# EAGLE design MAIN_PCB_[V0.2] (EAGLE 9.6.2)
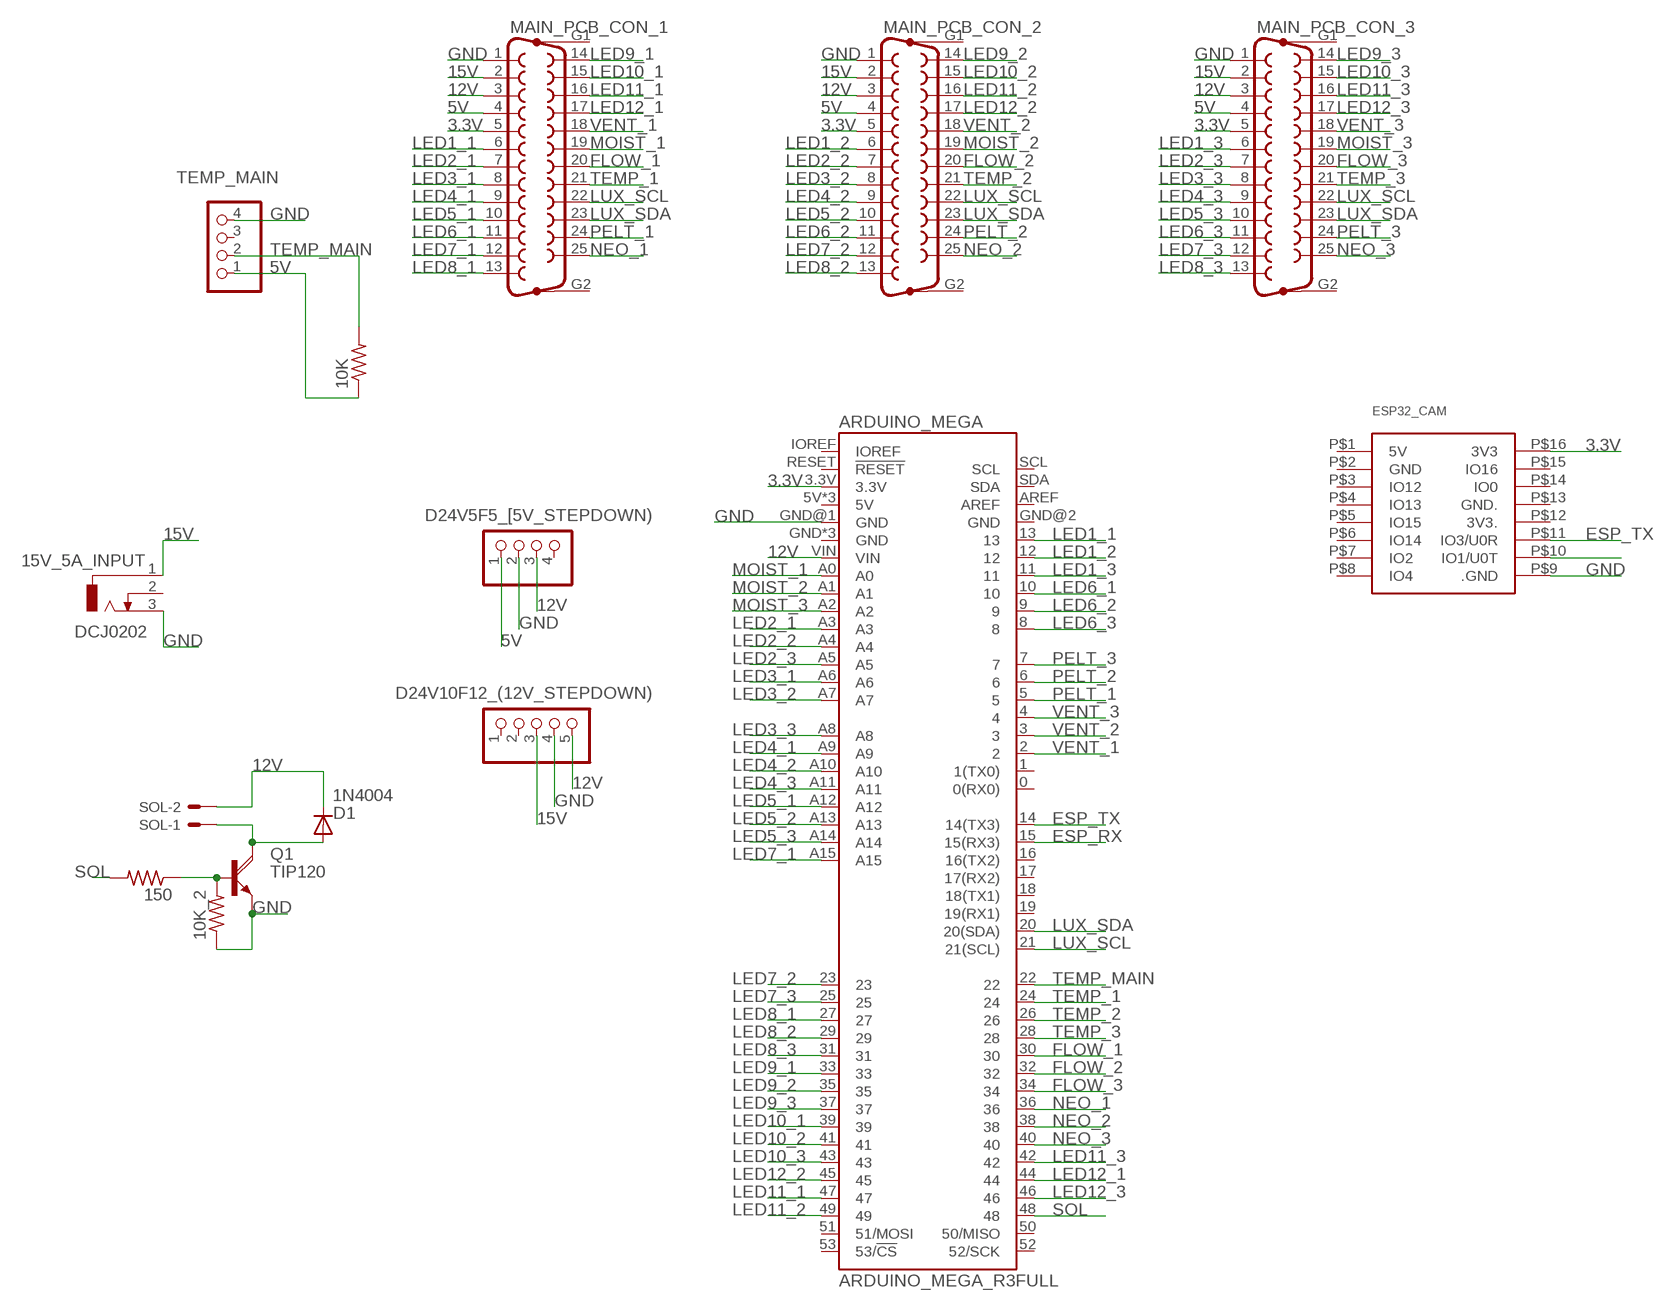
[diagram p0: schematic, sheet 1]

## Parts
10K  FLIPFLOP-RES  [0805-THM]
10K_2  FLIPFLOP-RES  [0805-THM]
15V_5A_INPUT  DCJ0202  [DCJ0202]
150  FLIPFLOP-RES  [0805-THM]
ARDUINO_MEGA  ARDUINO_MEGA_R3FULL  [ARDUINO_MEGA_NO_SILK]
D1  1N4004  [DO41-10]
D24V5F5_[5V_STEPDOWN)  PINHD-1X4  [1X04]
D24V10F12_(12V_STEPDOWN)  PINHD-1X5  [1X05]
ESP32_CAM  ESP32-CAM  [ESP32-CAM]
MAIN_PCB_CON_1  F25VP  [F25VP]
MAIN_PCB_CON_2  F25VP  [F25VP]
MAIN_PCB_CON_3  F25VP  [F25VP]
Q1  TIP120  [TO220AH]
SOL  JST-XH-02-PIN-LONG-PAD  [JST-XH-02-PACKAGE-LONG-PAD]
TEMP_MAIN  PINHD-1X4  [1X04]

## Nets
3.3V: ARDUINO_MEGA.3.3V ESP32_CAM.P$16(3V3) MAIN_PCB_CON_1.5 MAIN_PCB_CON_2.5 MAIN_PCB_CON_3.5
5V: 10K.1 D24V5F5_[5V_STEPDOWN).1 MAIN_PCB_CON_1.4 MAIN_PCB_CON_2.4 MAIN_PCB_CON_3.4 TEMP_MAIN.1
12V: ARDUINO_MEGA.VIN D1.C D24V5F5_[5V_STEPDOWN).3 D24V10F12_(12V_STEPDOWN).5 MAIN_PCB_CON_1.3 MAIN_PCB_CON_2.3 MAIN_PCB_CON_3.3 SOL.2
15V: 15V_5A_INPUT.1 D24V10F12_(12V_STEPDOWN).3 MAIN_PCB_CON_1.2 MAIN_PCB_CON_2.2 MAIN_PCB_CON_3.2
ESP_RX: ARDUINO_MEGA.15(15(RX3)) ESP32_CAM.P$10(IO1/U0T)
ESP_TX: ARDUINO_MEGA.14(14(TX3)) ESP32_CAM.P$11(IO3/U0R)
FLOW_1: ARDUINO_MEGA.30 MAIN_PCB_CON_1.20
FLOW_2: ARDUINO_MEGA.32 MAIN_PCB_CON_2.20
FLOW_3: ARDUINO_MEGA.34 MAIN_PCB_CON_3.20
GND: 10K_2.1 15V_5A_INPUT.3 ARDUINO_MEGA.GND@1(GND) D24V5F5_[5V_STEPDOWN).2 D24V10F12_(12V_STEPDOWN).4 ESP32_CAM.P$9(.GND) MAIN_PCB_CON_1.1 MAIN_PCB_CON_2.1 MAIN_PCB_CON_3.1 Q1.E TEMP_MAIN.4
LED1_1: ARDUINO_MEGA.13 MAIN_PCB_CON_1.6
LED1_2: ARDUINO_MEGA.12 MAIN_PCB_CON_2.6
LED1_3: ARDUINO_MEGA.11 MAIN_PCB_CON_3.6
LED2_1: ARDUINO_MEGA.A3 MAIN_PCB_CON_1.7
LED2_2: ARDUINO_MEGA.A4 MAIN_PCB_CON_2.7
LED2_3: ARDUINO_MEGA.A5 MAIN_PCB_CON_3.7
LED3_1: ARDUINO_MEGA.A6 MAIN_PCB_CON_1.8
LED3_2: ARDUINO_MEGA.A7 MAIN_PCB_CON_2.8
LED3_3: ARDUINO_MEGA.A8 MAIN_PCB_CON_3.8
LED4_1: ARDUINO_MEGA.A9 MAIN_PCB_CON_1.9
LED4_2: ARDUINO_MEGA.A10 MAIN_PCB_CON_2.9
LED4_3: ARDUINO_MEGA.A11 MAIN_PCB_CON_3.9
LED5_1: ARDUINO_MEGA.A12 MAIN_PCB_CON_1.10
LED5_2: ARDUINO_MEGA.A13 MAIN_PCB_CON_2.10
LED5_3: ARDUINO_MEGA.A14 MAIN_PCB_CON_3.10
LED6_1: ARDUINO_MEGA.10 MAIN_PCB_CON_1.11
LED6_2: ARDUINO_MEGA.9 MAIN_PCB_CON_2.11
LED6_3: ARDUINO_MEGA.8 MAIN_PCB_CON_3.11
LED7_1: ARDUINO_MEGA.A15 MAIN_PCB_CON_1.12
LED7_2: ARDUINO_MEGA.23 MAIN_PCB_CON_2.12
LED7_3: ARDUINO_MEGA.25 MAIN_PCB_CON_3.12
LED8_1: ARDUINO_MEGA.27 MAIN_PCB_CON_1.13
LED8_2: ARDUINO_MEGA.29 MAIN_PCB_CON_2.13
LED8_3: ARDUINO_MEGA.31 MAIN_PCB_CON_3.13
LED9_1: ARDUINO_MEGA.33 MAIN_PCB_CON_1.14
LED9_2: ARDUINO_MEGA.35 MAIN_PCB_CON_2.14
LED9_3: ARDUINO_MEGA.37 MAIN_PCB_CON_3.14
LED10_1: ARDUINO_MEGA.39 MAIN_PCB_CON_1.15
LED10_2: ARDUINO_MEGA.41 MAIN_PCB_CON_2.15
LED10_3: ARDUINO_MEGA.43 MAIN_PCB_CON_3.15
LED11_1: ARDUINO_MEGA.47 MAIN_PCB_CON_1.16
LED11_2: ARDUINO_MEGA.49 MAIN_PCB_CON_2.16
LED11_3: ARDUINO_MEGA.42 MAIN_PCB_CON_3.16
LED12_1: ARDUINO_MEGA.44 MAIN_PCB_CON_1.17
LED12_2: ARDUINO_MEGA.45 MAIN_PCB_CON_2.17
LED12_3: ARDUINO_MEGA.46 MAIN_PCB_CON_3.17
LUX_SCL: ARDUINO_MEGA.21(21(SCL)) MAIN_PCB_CON_1.22 MAIN_PCB_CON_2.22 MAIN_PCB_CON_3.22
LUX_SDA: ARDUINO_MEGA.20(20(SDA)) MAIN_PCB_CON_1.23 MAIN_PCB_CON_2.23 MAIN_PCB_CON_3.23
MOIST_1: ARDUINO_MEGA.A0 MAIN_PCB_CON_1.19
MOIST_2: ARDUINO_MEGA.A1 MAIN_PCB_CON_2.19
MOIST_3: ARDUINO_MEGA.A2 MAIN_PCB_CON_3.19
N$1: D1.A Q1.C SOL.1
N$2: 10K_2.2 150.1 Q1.B
NEO_1: ARDUINO_MEGA.36 MAIN_PCB_CON_1.25
NEO_2: ARDUINO_MEGA.38 MAIN_PCB_CON_2.25
NEO_3: ARDUINO_MEGA.40 MAIN_PCB_CON_3.25
PELT_1: ARDUINO_MEGA.5 MAIN_PCB_CON_1.24
PELT_2: ARDUINO_MEGA.6 MAIN_PCB_CON_2.24
PELT_3: ARDUINO_MEGA.7 MAIN_PCB_CON_3.24
SOL: 150.2 ARDUINO_MEGA.48
TEMP_1: ARDUINO_MEGA.24 MAIN_PCB_CON_1.21
TEMP_2: ARDUINO_MEGA.26 MAIN_PCB_CON_2.21
TEMP_3: ARDUINO_MEGA.28 MAIN_PCB_CON_3.21
TEMP_MAIN: 10K.2 ARDUINO_MEGA.22 TEMP_MAIN.2
VENT_1: ARDUINO_MEGA.2 MAIN_PCB_CON_1.18
VENT_2: ARDUINO_MEGA.3 MAIN_PCB_CON_2.18
VENT_3: ARDUINO_MEGA.4 MAIN_PCB_CON_3.18
Unconnected: 15V_5A_INPUT.2 ARDUINO_MEGA.0(0(RX0)) ARDUINO_MEGA.1(1(TX0)) ARDUINO_MEGA.5V ARDUINO_MEGA.5V@1(5V) ARDUINO_MEGA.5V@2(5V) ARDUINO_MEGA.16(16(TX2)) ARDUINO_MEGA.17(17(RX2)) ARDUINO_MEGA.18(18(TX1)) ARDUINO_MEGA.19(19(RX1)) ARDUINO_MEGA.50(50/MISO) ARDUINO_MEGA.51(51/MOSI) ARDUINO_MEGA.52(52/SCK) ARDUINO_MEGA.53(53/!CS) ARDUINO_MEGA.AREF ARDUINO_MEGA.GND ARDUINO_MEGA.GND@2(GND) ARDUINO_MEGA.GND@3(GND) ARDUINO_MEGA.GND@4(GND) ARDUINO_MEGA.IOREF ARDUINO_MEGA.RESET(!RESET) ARDUINO_MEGA.SCL ARDUINO_MEGA.SDA D24V5F5_[5V_STEPDOWN).4 D24V10F12_(12V_STEPDOWN).1 D24V10F12_(12V_STEPDOWN).2 ESP32_CAM.P$1(5V) ESP32_CAM.P$2(GND) ESP32_CAM.P$3(IO12) ESP32_CAM.P$4(IO13) ESP32_CAM.P$5(IO15) ESP32_CAM.P$6(IO14) ESP32_CAM.P$7(IO2) ESP32_CAM.P$8(IO4) ESP32_CAM.P$12(3V3.) ESP32_CAM.P$13(GND.) ESP32_CAM.P$14(IO0) ESP32_CAM.P$15(IO16) MAIN_PCB_CON_1.G1 MAIN_PCB_CON_1.G2 MAIN_PCB_CON_2.G1 MAIN_PCB_CON_2.G2 MAIN_PCB_CON_3.G1 MAIN_PCB_CON_3.G2 TEMP_MAIN.3

## Library data of the parts
10K 10K_2 150 = adafruit:FLIPFLOP-RES: Flip Flop resistor An 0805 resistor inside a standard 1/4W 5% resistor. Makes for easy mods
15V_5A_INPUT = con-jack:DCJ0202: DC POWER JACK Source: DCJ0202.pdf; OC_FARNELL: unknown; OC_NEWARK: unknown
ARDUINO_MEGA = SparkFun-Boards:ARDUINO_MEGA_R3: Arduino Mega R3 ATmega2560 R3 compatible footprint. SparkFun Products: Arduino Mega 2560 R3 <https://www.sparkfun.com/products/11061>
D1 = adafruit:1N4004: DIODE General purpose 1N400x type rectifier (With bigger pads) http://www.ladyada.net/library/pcb/eaglelibrary.html
D24V5F5_[5V_STEPDOWN) TEMP_MAIN = pinhead:PINHD-1X4: PIN HEADER
D24V10F12_(12V_STEPDOWN) = pinhead:PINHD-1X5: PIN HEADER
ESP32_CAM = ESP32-CAM:ESP32-CAM: Check availability <https://pricing.snapeda.com/parts/ESP32-CAM/AI-Thinker/view-part?ref=eda>; AVAILABILITY: Not in stock; DESCRIPTION: ESP32 ESP32 Transceiver; 802.11 a/b/g/n (Wi-Fi, WiFi, WLAN), Bluetooth® Smart 4.x Low Energy (BLE) Evaluation Board; MF: AI-Thinker; MP: ESP32-CAM; PACKAGE: None; PRICE: None
MAIN_PCB_CON_1-MAIN_PCB_CON_3 = con-subd:F25VP: SUB-D; OC_FARNELL: unknown; OC_NEWARK: unknown
Q1 = transistor-power:TIP120: NPN DARLINGTON TRANSISTOR
SOL = Rembrandt Electronics - JST XH Connectors v1-0:JST-XH-02-PIN: JST XH Connector 2 Pin Wire to board connector. Pitch: 2,54 mm, (0.100") Number of pins: 2 Created by Rembrandt Electronics www.rembrandtelectronics.com

## Board
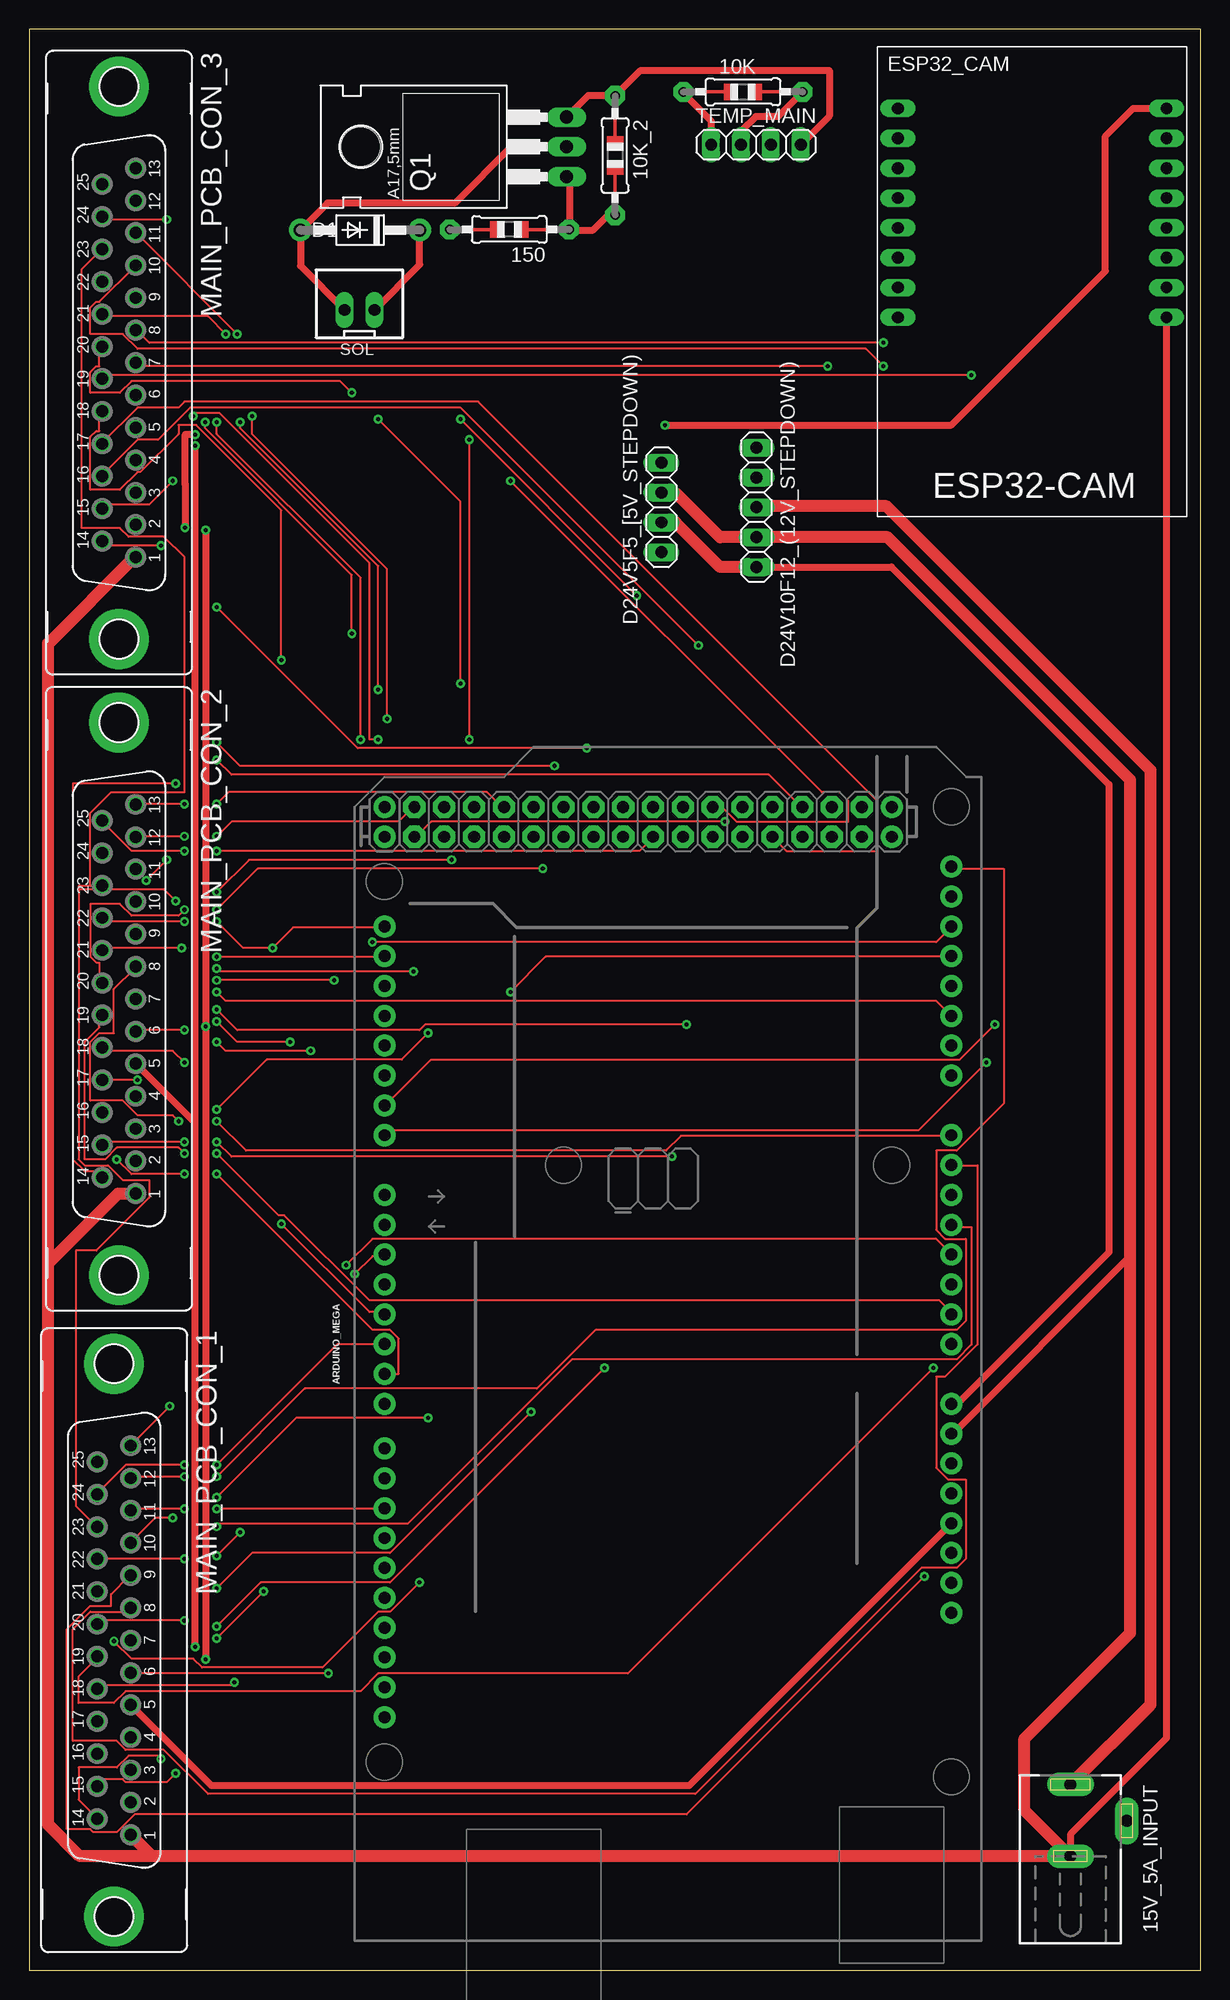
[diagram p1: board, top side]
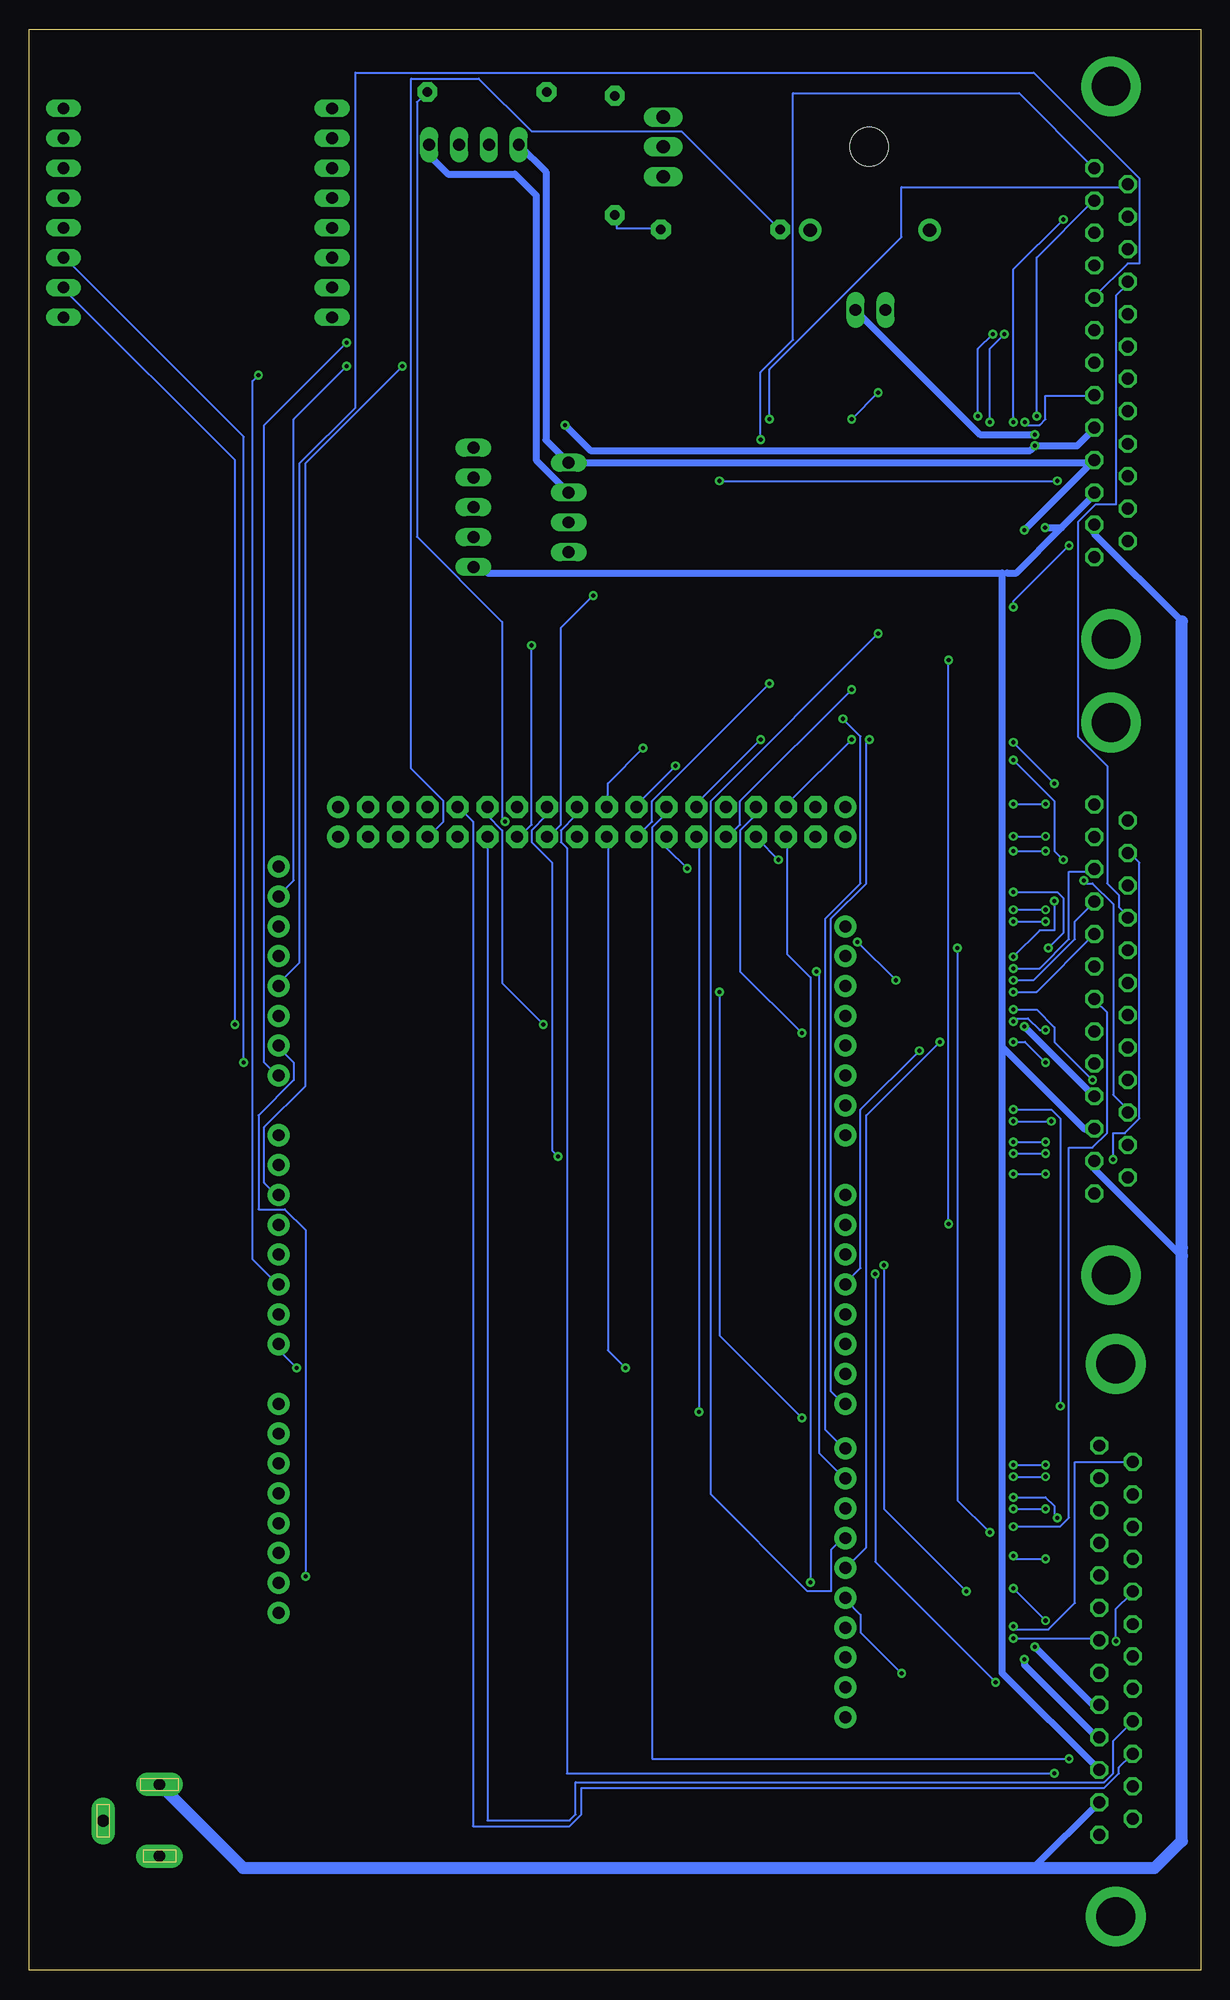
[diagram p2: board, bottom side, seen from below]

Size 99.7 x 165.18 mm. Coordinates in mm from the lower left corner, seen from the top.
Outline: 0,0 99.7,0 99.7,165.18 0,165.18 0,0
Copper layers (1*16): Top 0.035mm / dielectric 1.5mm / Bottom 0.035mm
Design rules "default": minimum track width 6mil, minimum drill 0.35mm, track to track 6mil, track to pad 6mil, pad to pad 6mil, via to via 6mil, smd to smd 6mil, copper to edge 40mil, drill to drill 6mil, minimum pad ring 10mil, minimum via ring 8mil, stop-mask expansion 4mil, vias tented up to drill 0mil, thermal gap 10mil

### Footprints (pad centres in the part's own frame; a part is rotated, then mirrored left to right if it is on the bottom)
0805-THM = drill 0.813 pad 1.676 octagon: 1 -5.08,0; 2 5.08,0
DCJ0202 = drill 1 pad 2 long: 1 0,3.1; 2 4.8,0; 3 0,-3
ARDUINO_MEGA_NO_SILK = drill 1.016 pad 1.88: 0 13.97,24.13; 1 11.43,24.13; 2 8.89,24.13; 3 6.35,24.13; 3.3V -13.97,-24.13; 4 3.81,24.13; 5 1.27,24.13; 5V -11.43,-24.13; 5V@1 44.45,24.13; 5V@2 46.99,24.13; 6 -1.27,24.13; 7 -3.81,24.13; 8 -7.62,24.13; 9 -10.16,24.13; 10 -12.7,24.13; 11 -15.24,24.13; 12 -17.78,24.13; 13 -20.32,24.13; 14 19.05,24.13; 15 21.59,24.13; 16 24.13,24.13; 17 26.67,24.13; 18 29.21,24.13; 19 31.75,24.13; 20 34.29,24.13; 21 36.83,24.13; A0 1.27,-24.13; A1 3.81,-24.13; A2 6.35,-24.13; A3 8.89,-24.13; A4 11.43,-24.13; A5 13.97,-24.13; A6 16.51,-24.13; A7 19.05,-24.13; A8 24.13,-24.13; A9 26.67,-24.13; A10 29.21,-24.13; A11 31.75,-24.13; A12 34.29,-24.13; A13 36.83,-24.13; A14 39.37,-24.13; A15 41.91,-24.13; AREF -25.4,24.13; GND -8.89,-24.13; GND@1 -6.35,-24.13; GND@2 44.45,-19.05; GND@3 46.99,-19.05; GND@4 -22.86,24.13; IOREF -19.05,-24.13; NC -21.59,-24.13; RESET -16.51,-24.13; SCL -30.48,24.13; SDA -27.94,24.13; VIN -3.81,-24.13 | drill 1.016 pad 1.88 octagon: 22 44.45,21.59; 23 46.99,21.59; 24 44.45,19.05; 25 46.99,19.05; 26 44.45,16.51; 27 46.99,16.51; 28 44.45,13.97; 29 46.99,13.97; 30 44.45,11.43; 31 46.99,11.43; 32 44.45,8.89; 33 46.99,8.89; 34 44.45,6.35; 35 46.99,6.35; 36 44.45,3.81; 37 46.99,3.81; 38 44.45,1.27; 39 46.99,1.27; 40 44.45,-1.27; 41 46.99,-1.27; 42 44.45,-3.81; 43 46.99,-3.81; 44 44.45,-6.35; 45 46.99,-6.35; 46 44.45,-8.89; 47 46.99,-8.89; 48 44.45,-11.43; 49 46.99,-11.43; 50 44.45,-13.97; 51 46.99,-13.97; 52 44.45,-16.51; 53 46.99,-16.51
DO41-10 = drill 1.118 pad 1.93: A 5.08,0; C -5.08,0
1X04 = drill 1.016 long: 1 -3.81,0; 2 -1.27,0; 3 1.27,0; 4 3.81,0
1X05 = drill 1.016 long: 1 -5.08,0; 2 -2.54,0; 3 0,0; 4 2.54,0; 5 5.08,0
ESP32-CAM = drill 1 pad 1.422 long: P$1 -11.43,10.16; P$2 -11.43,7.62; P$3 -11.43,5.08; P$4 -11.43,2.54; P$5 -11.43,0; P$6 -11.43,-2.54; P$7 -11.43,-5.08; P$8 -11.43,-7.62; P$9 11.43,-7.62; P$10 11.43,-5.08; P$11 11.43,-2.54; P$12 11.43,0; P$13 11.43,2.54; P$14 11.43,5.08; P$15 11.43,7.62; P$16 11.43,10.16
F25VP = drill 1.016 octagon: 1 16.561,1.422; 2 13.792,1.422; 3 11.049,1.422; 4 8.28,1.422; 5 5.512,1.422; 6 2.769,1.422; 7 0,1.422; 8 -2.769,1.422; 9 -5.512,1.422; 10 -8.28,1.422; 11 -11.049,1.422; 12 -13.792,1.422; 13 -16.561,1.422; 14 15.189,-1.422; 15 12.421,-1.422; 16 9.652,-1.422; 17 6.909,-1.422; 18 4.14,-1.422; 19 1.372,-1.422; 20 -1.372,-1.422; 21 -4.14,-1.422; 22 -6.909,-1.422; 23 -9.652,-1.422; 24 -12.421,-1.422; 25 -15.189,-1.422 | drill 3.302 pad 5.08: G1 -23.52,0; G2 23.52,0
TO220AH = drill 1.118 long: B -2.54,-6.35; C 0,-6.35; E 2.54,-6.35 | hole 3.302: 0,11.176
JST-XH-02-PACKAGE-LONG-PAD = drill 1.016 long: 1 -1.27,0; 2 1.27,0

### Placement (x,y rotation side)
10K  60.75,159.86 0 top
10K_2  49.86,154.45 270 top
15V_5A_INPUT  88.62,12.7 0 top
150  40.86,148.15 180 top
ARDUINO_MEGA  54.36,52.01 90 top
D1  28.15,148.1 180 top
D24V5F5_[5V_STEPDOWN)  53.8,124.49 270 top
D24V10F12_(12V_STEPDOWN)  61.9,124.5 270 top
ESP32_CAM  85.36,148.29 0 top
MAIN_PCB_CON_1  7.21,28.08 270 top
MAIN_PCB_CON_2  7.62,82.66 270 top
MAIN_PCB_CON_3  7.62,136.81 270 top
Q1  39.39,155.18 90 top
SOL  28.1,141.3 0 top
TEMP_MAIN  61.85,155.36 0 top

### Tracks (layer width: path | path; a pad name or v marks a point on that pad's centre or on a via)
3.3V  (via drill 0.35)
  Top 0.61: ARDUINO_MEGA.3.3V 56.15,15.7 15.5,15.7 MAIN_PCB_CON_1.5 | v14.1,27.5 14.1,72.09 | 14.1,72.09 MAIN_PCB_CON_2.5 | 14.1,72.09 v14.1,129.74 | v54.1,131.5 78.5,131.5 91.6,144.6 91.6,156.1 93.95,158.45 ESP32_CAM.P$16
  Bottom 0.61: MAIN_PCB_CON_1.5 9.17,22.57 v14.1,27.5 | MAIN_PCB_CON_3.5 9.04,131.2 10.5,129.74 v14.1,129.74 14.5,129.34 51.94,129.34 v54.1,131.5
5V  (via drill 0.35)
  Top 0.61: v15,122.57 v15,80.3 v15,26.47 | v9.08,74.38 MAIN_PCB_CON_2.4 | 10K.1 55.67,159.76 58.04,157.39 TEMP_MAIN.1
  Bottom 0.61: v15,122.57 MAIN_PCB_CON_3.4 9.27,128.3 D24V5F5_[5V_STEPDOWN).1 55.74,130.24 55.74,153.06 TEMP_MAIN.1 | v15,80.3 v9.08,74.38 | MAIN_PCB_CON_1.4 8.83,19.8 15,25.97 v15,26.47
12V  (via drill 0.35)
  Top 0.61: SOL.2 33.23,145.16 D1.C | D24V10F12_(12V_STEPDOWN).5 73.4,119.42 91.9,100.92 91.9,61.1 79,48.2 ARDUINO_MEGA.VIN | v13.24,122.76 13.24,126.46 13.26,126.48 13.26,130.69 13.28,130.7 v14.1,130.7
  Top 1.016: D24V5F5_[5V_STEPDOWN).3 55,123.22 58.8,119.42 D24V10F12_(12V_STEPDOWN).5
  Bottom 0.152: 16.48,118.92 16.7,119 16.9,118.92
  Bottom 0.61: D24V10F12_(12V_STEPDOWN).5 61.2,119.42 60.7,118.92 16.9,118.92 16.9,78.6 | 16.48,118.92 15.68,118.92 11.84,122.76 | MAIN_PCB_CON_3.3 9.04,125.56 11.84,122.76 | 16.9,78.6 9.91,71.61 MAIN_PCB_CON_2.3 | 16.9,78.6 16.9,25.3 MAIN_PCB_CON_1.3 | SOL.2 18.77,130.7 v14.1,130.7 | v13.24,122.76 11.84,122.76
15V
  Top 1.016: 15V_5A_INPUT.1 95.42,22.6 95.42,102.13 72.97,124.58 61.98,124.58 D24V10F12_(12V_STEPDOWN).3
  Bottom 0.152: 1.6,61.5 1.95,61.5 2.15,61.3
  Bottom 0.61: MAIN_PCB_CON_1.2 14.22,8.7 | 1.6,114.8 9.04,122.24 MAIN_PCB_CON_3.2 | MAIN_PCB_CON_2.2 9.04,68.19 2.15,61.3 1.6,60.75
  Bottom 1.016: 15V_5A_INPUT.1 81.52,8.7 14.22,8.7 3.9,8.7 1.6,11 1.6,60.75 | 1.6,60.8 1.6,61.5 1.6,114.8
ESP_RX  (via drill 0.35)
  Top 0.152: v82.2,80.5 79.2,77.5 34.2,77.5 30.45,73.75 ARDUINO_MEGA.15
  Bottom 0.152: v82.2,80.5 82.2,128.5 96.7,143 ESP32_CAM.P$10
ESP_TX  (via drill 0.35)
  Top 0.152: v81.45,77.25 75.7,71.5 30.7,71.5 30.45,71.25 ARDUINO_MEGA.14
  Bottom 0.152: v81.45,77.25 81.45,130.5 96.7,145.75 ESP32_CAM.P$11
FLOW_1  (via drill 0.35)
  Top 0.152: v13.2,29.75 6.2,29.75 5.95,29.5 MAIN_PCB_CON_1.20 | v15.95,32.5 18.95,35.5 30.7,35.5 v42.7,47.5
  Bottom 0.152: v15.95,32.5 v13.2,29.75 | v42.7,47.5 42.7,96.25 ARDUINO_MEGA.30
FLOW_2  (via drill 0.35)
  Top 0.152: v13.2,90.25 12.7,89.75 8.7,89.75 7.7,90.75 5.2,90.75 5.2,86.25 5.7,85.75 5.95,85.75 5.95,84.25 MAIN_PCB_CON_2.20 | v15.95,90.25 19.45,93.75 v43.7,93.75
  Bottom 0.152: v15.95,90.25 v13.2,90.25 | v43.7,93.75 45.45,95.5 45.45,96.25 ARDUINO_MEGA.32
FLOW_3  (via drill 0.35)
  Top 0.152: v27.45,134.25 26.45,135.25 8.7,135.25 7.7,134.25 5.2,134.25 5.2,136 5.7,136.5 5.95,136.5 5.95,138 MAIN_PCB_CON_3.20 | v29.7,132 36.7,125 v36.7,109.5
  Bottom 0.152: v29.7,132 v27.45,134.25 | v36.7,109.5 46.7,99.5 46.7,97.75 47.95,96.5 ARDUINO_MEGA.34
GND
  Top 0.152: 49.7,159.56 49.7,159.5 10K_2.1
  Top 0.508: 15V_5A_INPUT.3 87.8,9.7 87.5,10
  Top 0.61: 15V_5A_INPUT.3 88.62,11.56 96.79,19.73 ESP32_CAM.P$9 | Q1.E 47.58,159.56 49.7,159.56 49.86,159.56 | 10K_2.1 52.03,161.7 68.1,161.7 68.1,157.8 TEMP_MAIN.4 | ARDUINO_MEGA.GND@1 78.61,45.66 93.65,60.7 93.7,60.7
  Top 1.016: D24V5F5_[5V_STEPDOWN).2 53.8,125.66 55.1,125.66 58.8,121.96 D24V10F12_(12V_STEPDOWN).4 73.04,121.96 93.7,101.3 93.7,60.7 93.7,28.7 84.7,19.7 84.7,13.62 15V_5A_INPUT.3 10.45,9.7 | 10.45,9.7 MAIN_PCB_CON_1.1 | 10.45,9.7 4.3,9.7 1.6,12.4 1.6,60.16 | MAIN_PCB_CON_2.1 7.54,66.1 1.6,60.16 | 1.6,60.16 1.6,112.91 8.94,120.25 MAIN_PCB_CON_3.1
  Bottom 0.61: TEMP_MAIN.4 65.66,154.46 64.06,152.86 58.36,152.86 56.56,151.06 56.56,128.52 D24V5F5_[5V_STEPDOWN).2
LED1_1  (via drill 0.35)
  Top 0.152: v25.45,25.25 8.7,25.25 MAIN_PCB_CON_1.6
  Bottom 0.152: v25.45,25.25 28.95,28.75 28.95,30.25 30.2,31.5 ARDUINO_MEGA.13
LED1_2  (via drill 0.35)
  Top 0.152: v13.2,80 9.2,80 MAIN_PCB_CON_2.6 | v15.95,80.75 17.7,79 v22.2,79
  Bottom 0.152: v13.2,80 13.7,80 14.7,81 15.95,81 v15.95,80.75 | v22.2,79 28.45,72.75 28.45,36 30.2,34.25 ARDUINO_MEGA.12
LED1_3  (via drill 0.35)
  Top 0.152: v14.95,131.75 14.95,131.25 27.45,118.75 v27.45,113.75
  Bottom 0.152: v14.95,131.75 14.95,131.5 13.7,131.5 13.2,132 13.2,134 9.2,134 MAIN_PCB_CON_3.6 | v27.45,113.75 41.7,99.5 41.7,40.5 33.45,32.25 31.45,32.25 31.45,35.75 30.45,36.75 ARDUINO_MEGA.11
LED2_1  (via drill 0.35)
  Top 0.152: v19.95,32.25 v15.95,28.25 | v26.95,60 29.2,62.25 77.2,62.25 78.45,61 ARDUINO_MEGA.A3
  Bottom 0.152: v15.95,28.25 8.7,28.25 MAIN_PCB_CON_1.7 | v19.95,32.25 26.95,39.25 v26.95,60
LED2_2  (via drill 0.35)
  Top 0.152: v15.95,37.75 16.2,38 32.2,38 46.2,52 78.95,52 80.2,53.25 80.2,63.25 78.7,63.25 ARDUINO_MEGA.A4
  Bottom 0.152: v15.95,37.75 11.95,37.75 11.2,38.5 11.2,70 9.2,70 7.95,71.25 7.95,81.5 8.95,82.5 MAIN_PCB_CON_2.7
LED2_3  (via drill 0.35)
  Top 0.152: v67.95,136.5 9.45,136.5 9.2,136.75 MAIN_PCB_CON_3.7
  Bottom 0.152: v67.95,136.5 76.2,128.25 76.2,75.25 79.7,71.75 79.7,67 78.7,66 ARDUINO_MEGA.A5
LED3_1
  Top 0.152: MAIN_PCB_CON_1.8 8.45,30.75 8.2,30.5 5.2,30.5 3.7,29 3.7,19.5 7.45,19.5 8.2,18.75 11.45,18.75 15.2,15 56.7,15 75.95,34.25 78.95,34.25 79.7,35 79.7,41.75 78.2,41.75 77.2,42.75 77.2,50.5 77.95,50.5 80.7,53.25 80.7,68.5 78.7,68.5 ARDUINO_MEGA.A6
LED3_2  (via drill 0.35)
  Top 0.152: v12.7,72.25 12.2,72.75 9.2,72.75 7.95,74 5.2,74 5.2,79 5.95,79.75 7.2,79.75 7.2,83.5 8.95,85.25 MAIN_PCB_CON_2.8 | v15.95,72.25 18.45,69.75 54.2,69.75 55.45,71 78.45,71 ARDUINO_MEGA.A7
  Bottom 0.152: v15.95,72.25 v12.7,72.25
LED3_3  (via drill 0.35)
  Top 0.152: v72.7,138.5 10.2,138.5 9.2,139.5 MAIN_PCB_CON_3.8
  Bottom 0.152: v72.7,138.5 79.7,131.5 79.7,77.25 78.7,76.25 ARDUINO_MEGA.A8
LED4_1  (via drill 0.35)
  Top 0.152: v76.2,33.5 55.95,13.25 8.95,13.25 7.45,11.75 5.45,11.75 5.2,12 3.2,12 3.2,29 5.2,31 6.95,31 6.95,32 8.45,33.5 MAIN_PCB_CON_1.9
  Bottom 0.152: v76.2,33.5 76.2,63 77.95,64.75 80.2,64.75 80.2,72.75 77.2,75.75 77.2,77.25 78.45,78.5 ARDUINO_MEGA.A9
LED4_2  (via drill 0.35)
  Top 0.152: v15.95,83.25 16.7,82.5 77.2,82.5 78.45,81.25 ARDUINO_MEGA.A10
  Bottom 0.152: v15.95,83.25 13.95,83.25 9.2,88 MAIN_PCB_CON_2.9
LED4_3
  Bottom 0.152: MAIN_PCB_CON_3.9 8.95,142.5 6.2,145.25 5.2,145.25 5.2,152.5 14.2,161.5 71.95,161.5 71.95,133 76.7,128.25 76.7,85.75 78.45,84 ARDUINO_MEGA.A11
LED5_1  (via drill 0.35)
  Top 0.152: v12.2,38.5 10.7,38.5 8.7,36.5 MAIN_PCB_CON_1.10 | v15.95,40.25 22.7,47 v33.95,47 | v40.95,83.25 43.95,86.25 78.45,86.25 ARDUINO_MEGA.A12
  Bottom 0.152: v12.2,38.5 12.45,38.75 12.45,39.5 13.2,40.25 v15.95,40.25 | v33.95,47 40.95,54 v40.95,83.25
LED5_2  (via drill 0.35)
  Top 0.152: v25.95,84.25 v15.95,84.25 | v29.2,87.5 77.2,87.5 78.45,88.75 ARDUINO_MEGA.A13
  Bottom 0.152: v15.95,84.25 14.2,84.25 10.7,87.75 10.7,89.25 9.2,90.75 MAIN_PCB_CON_2.10 | v29.2,87.5 v25.95,84.25
LED5_3  (via drill 0.35)
  Top 0.152: v72.7,136.5 71.2,138 9.2,138 7.95,139.25 5.2,139.25 5.2,141.5 5.7,142 5.95,142 8.95,145 MAIN_PCB_CON_3.10
  Bottom 0.152: v72.7,136.5 77.2,132 77.2,92.75 78.45,91.5 ARDUINO_MEGA.A14
LED6_1  (via drill 0.35)
  Top 0.152: v13.2,39.25 8.7,39.25 MAIN_PCB_CON_1.11 | v15.95,39.25 30.2,39.25 ARDUINO_MEGA.10
  Bottom 0.152: v15.95,39.25 v13.2,39.25
LED6_2  (via drill 0.35)
  Top 0.152: v15.95,85.25 16.2,85 v32.7,85
  Bottom 0.152: v15.95,85.25 13.7,85.25 11.2,87.75 11.2,93.5 9.2,93.5 MAIN_PCB_CON_2.11 | v32.7,85 32.45,84.75 32.45,44 30.45,42 ARDUINO_MEGA.9
LED6_3  (via drill 0.35)
  Top 0.152: v17.7,139.25 9.2,147.75 MAIN_PCB_CON_3.11 | v18.95,132.25 18.95,130.75 30.45,119.25 v30.45,106.5
  Bottom 0.152: v17.7,139.25 18.95,138 v18.95,132.25 | v30.45,106.5 28.95,105 28.95,92.5 31.95,89.5 31.95,46 30.45,44.5 ARDUINO_MEGA.8
LED7_1  (via drill 0.35)
  Top 0.152: v13.2,42 8.7,42 MAIN_PCB_CON_1.12 | v15.95,42 23.45,49.5 43.2,49.5 48.2,54.5 78.95,54.5 79.7,55.25 79.7,62.25 77.95,62.25 77.2,63 77.2,69.75 78.95,69.75 82.95,73.75 82.95,93.75 78.7,93.75 ARDUINO_MEGA.A15
  Bottom 0.152: v15.95,42 v13.2,42
LED7_2  (via drill 0.35)
  Top 0.152: v13.2,96.5 9.2,96.5 MAIN_PCB_CON_2.12 | v15.95,96.5 17.2,97.75 31.45,97.75 32.7,99 ARDUINO_MEGA.23
  Bottom 0.152: v15.95,96.5 v13.2,96.5
LED7_3  (via drill 0.35)
  Top 0.152: v13.95,132.25 14.2,132.5 16.2,132.5 28.95,119.75 28.95,104.75 v29.7,104.75
  Bottom 0.152: v13.95,132.25 13.95,145.75 9.2,150.5 MAIN_PCB_CON_3.12 | v29.7,104.75 35.2,99.25 35.2,99 ARDUINO_MEGA.25
LED8_1  (via drill 0.35)
  Top 0.152: v11.95,48 8.7,44.75 MAIN_PCB_CON_1.13 | v15.95,73.25 20.2,77.5 31.7,77.5 v33.95,79.75
  Bottom 0.152: v11.95,48 11.95,72.5 12.7,73.25 v15.95,73.25 | v33.95,79.75 39.2,85 39.2,97 37.95,98.25 37.95,99 ARDUINO_MEGA.27
LED8_2  (via drill 0.35)
  Top 0.152: v13.2,99.25 9.2,99.25 MAIN_PCB_CON_2.13 | v15.95,99.25 16.95,100.25 38.95,100.25 40.2,99 ARDUINO_MEGA.29
  Bottom 0.152: v15.95,99.25 v13.2,99.25
LED8_3  (via drill 0.35)
  Top 0.152: v37.45,104.75 v37.45,130.25
  Bottom 0.152: v37.45,130.25 37.45,136 34.7,138.75 34.7,159.75 15.45,159.75 9.2,153.5 MAIN_PCB_CON_3.13 | v37.45,104.75 42.7,99.5 42.7,99 ARDUINO_MEGA.31
LED9_1  (via drill 0.35)
  Top 0.152: v11.2,18 10.95,18.25 8.45,18.25 7.45,17.25 4.2,17.25 4.2,14.5 5.7,13 MAIN_PCB_CON_1.14
  Bottom 0.152: v11.2,18 46.7,18 46.7,97.25 45.7,98.25 45.7,99 ARDUINO_MEGA.33
LED9_2  (via drill 0.35)
  Top 0.152: v12.45,101 3.7,101 3.7,69 4.7,68 5.45,68 5.95,67.5 MAIN_PCB_CON_2.14 | v15.95,104.5 17.95,102.5 v44.7,102.5
  Bottom 0.152: v15.95,104.5 v12.45,101 | v44.7,102.5 47.95,99.25 47.95,99 ARDUINO_MEGA.35
LED9_3  (via drill 0.35)
  Top 0.152: v11.2,121.25 6.45,121.25 6.2,121.5 MAIN_PCB_CON_3.14 | v15.95,116 27.95,104 v47.45,104
  Bottom 0.152: v11.2,121.25 15.95,116.5 v15.95,116 | v47.45,104 50.45,101 50.45,99 ARDUINO_MEGA.37
LED10_1  (via drill 0.35)
  Top 0.152: v12.45,16.75 11.7,16 8.2,16 7.95,16.25 6.45,16.25 5.95,15.75 MAIN_PCB_CON_1.15
  Bottom 0.152: v12.45,16.75 53.95,16.75 53.95,95.5 54.45,96 54.45,97 53.2,98.25 53.2,99 ARDUINO_MEGA.39
LED10_2  (via drill 0.35)
  Top 0.152: v13.2,70.5 6.45,70.5 MAIN_PCB_CON_2.15 | v15.95,70.5 17.2,69.25 v54.7,69.25
  Bottom 0.152: v15.95,70.5 v13.2,70.5 | v54.7,69.25 55.2,69.75 55.2,94.25 56.95,96 56.95,97 55.7,98.25 55.7,99 ARDUINO_MEGA.41
LED10_3  (via drill 0.35)
  Top 0.152: v12.2,126.75 10.2,124.75 6.45,124.75 6.2,124.5 MAIN_PCB_CON_3.15 | v40.95,126.75 67.45,100.25 68.95,100.25 69.7,99.5 69.7,97.75 60.2,97.75 58.95,99 ARDUINO_MEGA.43
  Bottom 0.152: v40.95,126.75 v12.2,126.75
LED11_1
  Bottom 0.152: MAIN_PCB_CON_1.16 5.95,18.25 6.95,17.25 6.95,16.75 8.2,15.5 52.7,15.5 52.7,13.25 53.7,12.25 61.95,12.25 61.95,97.75 63.2,99 ARDUINO_MEGA.47
LED11_2  (via drill 0.35)
  Top 0.152: v11.7,94.5 v9.95,92.75 | v15.95,103 17.2,101.75 62.95,101.75 65.7,99 ARDUINO_MEGA.49
  Bottom 0.152: v9.95,92.75 9.95,92.5 9.2,92.5 7.45,90.75 7.45,74.5 6.2,73.25 MAIN_PCB_CON_2.16 | v11.7,94.5 12.45,95.25 12.45,99.5 v15.95,103
LED11_3  (via drill 0.35)
  Top 0.152: v56.95,112.75 36.7,133 13.7,133 10.95,130.25 9.2,130.25 6.2,127.25 MAIN_PCB_CON_3.16
  Bottom 0.152: v56.95,112.75 56.95,97.5 57.95,96.5 ARDUINO_MEGA.42
LED12_1
  Bottom 0.152: MAIN_PCB_CON_1.17 5.95,21 7.45,19.5 7.45,16.75 8.2,16 53.2,16 53.2,13.25 53.7,12.75 60.7,12.75 60.7,96.25 ARDUINO_MEGA.44
LED12_2  (via drill 0.35)
  Top 0.152: v9.2,75.75 MAIN_PCB_CON_2.17 | v15.95,81.75 17.7,80 33.2,80 33.7,80.5 v55.95,80.5
  Bottom 0.152: v9.2,75.75 12.45,79 12.45,80.25 13.95,81.75 v15.95,81.75 | v55.95,80.5 59.45,84 59.45,97 60.7,98.25 ARDUINO_MEGA.45
LED12_3
  Top 0.152: MAIN_PCB_CON_3.17 6.2,130 9.2,133 12.7,133 13.2,133.5 38.2,133.5 72.2,99.5 72.2,95.25 64.45,95.25 63.45,96.25 ARDUINO_MEGA.46
LUX_SCL  (via drill 0.35)
  Top 0.152: v13.2,35 5.95,35 MAIN_PCB_CON_1.22 | v17.95,37.25 v15.95,35.25 | ARDUINO_MEGA.21 30.2,88.75 22.45,88.75 v20.7,87 18.2,87 v15.95,89.25 | v13.2,89.25 6.45,89.25 6.2,89.5 MAIN_PCB_CON_2.22
  Bottom 0.152: MAIN_PCB_CON_2.22 6.2,89.75 6.95,90.5 6.95,91.5 7.95,92.5 7.95,102.5 10.45,105 10.45,123.25 8.95,124.75 7.2,124.75 7.2,142.5 6.2,143.5 MAIN_PCB_CON_3.22 | v13.2,35 15.95,35 v15.95,35.25 | v17.95,37.25 20.7,40 v20.7,87 | v15.95,89.25 v13.2,89.25
LUX_SDA  (via drill 0.35)
  Top 0.152: 4.2,92 4.2,92.25 5.2,92.25 | 4.2,92 4.2,69 4.7,68.5 6.7,68.5 7.95,67.25 10.2,67.25 10.2,65.75 5.7,61.25 3.95,61.25 3.95,39.5 5.7,37.75 MAIN_PCB_CON_1.23 | 5.2,92.25 5.95,92.25 MAIN_PCB_CON_2.23 | 5.2,92.25 5.2,98.5 6.95,100.25 13.2,100.25 13.2,120.25 11.45,122 8.45,122 7.7,122.75 4.45,122.75 4.45,144.75 5.95,146.25 MAIN_PCB_CON_3.23 | v15.95,86.25 30.2,86.25 ARDUINO_MEGA.20 | v12.45,91 11.45,92 4.2,92
  Bottom 0.152: v15.95,86.25 13.7,88.5 12.45,88.5 v12.45,91
MOIST_1  (via drill 0.35)
  Top 0.152: v76.95,51.25 50.95,25.25 29.7,25.25 28.2,23.75 8.2,23.75 7.2,22.75 4.2,22.75 4.2,25 5.7,26.5 MAIN_PCB_CON_1.19
  Bottom 0.152: v76.95,51.25 78.45,52.75 78.45,53.25 ARDUINO_MEGA.A0
MOIST_2  (via drill 0.35)
  Top 0.152: v13.2,69.5 12.7,70 7.45,70 6.45,69 4.7,69 4.7,79 5.95,80.25 5.95,81.25 MAIN_PCB_CON_2.19 | v15.95,69.5 21.2,64.25 21.7,64.25 28.95,57 77.45,57 78.45,56 ARDUINO_MEGA.A1
  Bottom 0.152: v15.95,69.5 v13.2,69.5
MOIST_3  (via drill 0.35)
  Top 0.152: v80.2,135.75 6.45,135.75 6.2,135.5 MAIN_PCB_CON_3.19
  Bottom 0.152: v80.2,135.75 80.7,135.25 80.7,60.5 78.7,58.5 ARDUINO_MEGA.A2
N$1
  Top 0.61: Q1.C 45.69,155.24 41.05,155.24 36.22,150.4 25.37,150.4 D1.A 23.07,145.06 SOL.1
N$2
  Top 0.152: 150.1 45.95,148.25 46.02,148.1
  Top 0.61: Q1.B 45.97,152.41 45.97,148.15 46.02,148.1 47.98,148.1 49.25,149.37
  Bottom 0.152: 150.1 45.95,148.25 49.7,148.25 49.7,149.25 10K_2.2
NEO_1  (via drill 0.35)
  Top 0.152: v15.95,29.25 19.7,33 30.7,33 v48.95,51.25
  Bottom 0.152: v15.95,29.25 15.95,29 12.95,29 10.7,31.25 10.7,43.25 5.95,43.25 MAIN_PCB_CON_1.25 | v48.95,51.25 50.45,52.75 50.45,96.25 ARDUINO_MEGA.36
NEO_2  (via drill 0.35)
  Top 0.152: v13.2,95.25 8.7,95.25 6.2,97.75 MAIN_PCB_CON_2.25 | v15.95,95.25 51.95,95.25 52.95,96.25 ARDUINO_MEGA.38
  Bottom 0.152: v15.95,95.25 v13.2,95.25
NEO_3  (via drill 0.35)
  Top 0.152: v51.7,117 v36.7,132
  Bottom 0.152: v36.7,132 36.7,136.25 25.45,147.5 25.45,151.75 6.2,151.75 MAIN_PCB_CON_3.25 | v51.7,117 54.45,114.25 54.45,97.5 55.45,96.5 ARDUINO_MEGA.40
PELT_1  (via drill 0.35)
  Top 0.152: v13.2,43 8.2,43 5.95,40.75 MAIN_PCB_CON_1.24 | v15.95,43 26.2,53.25 30.2,53.25 ARDUINO_MEGA.5
  Bottom 0.152: v15.95,43 v13.2,43
PELT_2  (via drill 0.35)
  Top 0.152: v7.45,69 8.7,67.75 v13.2,67.75 | v15.95,67.75 29.2,54.5 30.7,54.5 31.45,53.75 31.45,50.75 30.45,50.75 ARDUINO_MEGA.6
  Bottom 0.152: v7.45,69 7.45,71.25 6.45,71.25 5.2,72.5 5.2,94.25 5.95,95 MAIN_PCB_CON_2.24 | v15.95,67.75 v13.2,67.75
PELT_3  (via drill 0.35)
  Top 0.152: v11.7,149 6.2,149 MAIN_PCB_CON_3.24 | v15.95,131.75 15.95,130.75 28.2,118.5 v28.2,104.75
  Bottom 0.152: v11.7,149 15.95,144.75 v15.95,131.75 | v28.2,104.75 28.45,104.5 28.45,92.5 31.45,89.5 31.45,49.25 30.45,48.25 ARDUINO_MEGA.7
SOL
  Bottom 0.152: 150.2 35.95,148.25 44.2,156.5 56.95,156.5 61.45,161 67.2,161 67.2,102.25 64.45,99.5 64.45,97.75 65.7,96.5 ARDUINO_MEGA.48
TEMP_1  (via drill 0.35)
  Top 0.152: v7.2,28 8.7,26.5 13.95,26.5 14.7,25.75 24.95,25.75 29.7,30.5 30.7,30.5 v33.2,33
  Bottom 0.152: v7.2,28 7.2,30.75 5.95,32 MAIN_PCB_CON_1.21 | v33.2,33 33.2,84.5 35.2,86.5 35.2,96.25 ARDUINO_MEGA.24
TEMP_2  (via drill 0.35)
  Top 0.152: v12.95,87 6.2,87 MAIN_PCB_CON_2.21 | v15.95,91.75 18.7,94.5 v35.95,94.5
  Bottom 0.152: v12.95,87 11.7,88.25 11.7,91.25 12.2,91.75 v15.95,91.75 | v35.95,94.5 37.7,96.25 ARDUINO_MEGA.26
TEMP_3  (via drill 0.35)
  Top 0.152: v16.7,139.25 15.2,140.75 6.2,140.75 MAIN_PCB_CON_3.21 | v17.95,131.75 17.95,131.25 29.7,119.5 v29.7,109
  Bottom 0.152: v16.7,139.25 17.95,138 v17.95,131.75 | v29.7,109 39.2,99.5 39.2,97.5 40.2,96.5 ARDUINO_MEGA.28
TEMP_MAIN  (via drill 0.35)
  Top 0.152: v59.2,97.75 34.2,97.75 32.95,96.5 ARDUINO_MEGA.22
  Top 0.61: 10K.2 63.73,157.76 61.83,157.76 60.58,156.51 TEMP_MAIN.2
  Bottom 0.152: v59.2,97.75 59.45,98 59.45,114.75 66.7,122 66.7,159 65.95,159.75 10K.2
VENT_1  (via drill 0.35)
  Top 0.152: v17.45,24.5 17.2,24.25 6.2,24.25 5.95,24 MAIN_PCB_CON_1.18 | v27.7,59.25 29.2,60.75 30.2,60.75 ARDUINO_MEGA.2
  Bottom 0.152: v17.45,24.5 27.7,34.75 v27.7,59.25
VENT_2  (via drill 0.35)
  Top 0.152: v13.2,77.25 12.2,78.25 6.45,78.25 6.2,78.5 MAIN_PCB_CON_2.18 | v15.95,79 16.7,78.25 v23.95,78.25
  Bottom 0.152: v13.2,77.25 14.95,79 v15.95,79 | v23.95,78.25 28.95,73.25 28.95,59.75 30.2,58.5 ARDUINO_MEGA.3
VENT_3  (via drill 0.35)
  Top 0.152: v21.45,111.5 21.45,124.25 14.2,131.5 12.7,131.5 12.7,130.75 9.45,127.5 9.2,127.5 7.7,126 5.2,126 5.2,130.5 5.7,131 5.95,131 5.95,132.5 MAIN_PCB_CON_3.18 | v21.45,63.5 28.95,56 30.2,56 ARDUINO_MEGA.4
  Bottom 0.152: v21.45,63.5 v21.45,111.5